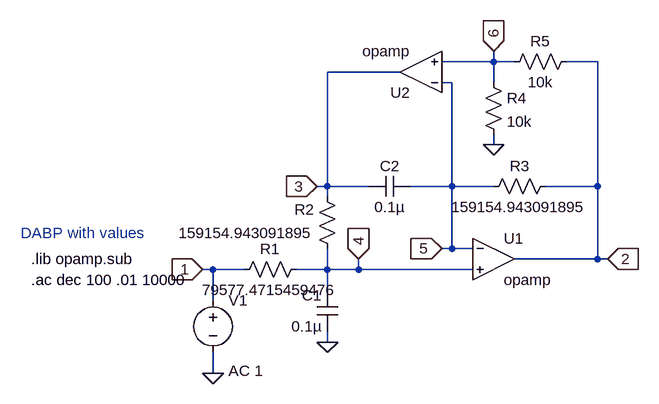
[diagram p0: schematic DABPn.asc]
DABPn.asc, the LTspice schematic file:
Version 4
SHEET 1 880 680
WIRE 272 -80 272 -96
WIRE 272 -80 192 -80
WIRE 304 -80 272 -80
WIRE 432 -80 384 -80
WIRE 128 -64 16 -64
WIRE 208 -48 192 -48
WIRE 272 -48 272 -80
WIRE 272 48 272 32
WIRE 16 112 16 -64
WIRE 16 112 0 112
WIRE 80 112 16 112
WIRE 208 112 208 -48
WIRE 208 112 144 112
WIRE 272 112 208 112
WIRE 432 112 432 -80
WIRE 432 112 352 112
WIRE 16 128 16 112
WIRE 208 208 208 112
WIRE 208 208 192 208
WIRE 240 208 208 208
WIRE 432 224 432 112
WIRE 432 224 304 224
WIRE 448 224 432 224
WIRE -160 240 -176 240
WIRE -112 240 -160 240
WIRE 16 240 16 208
WIRE 16 240 -32 240
WIRE 64 240 64 224
WIRE 64 240 16 240
WIRE 240 240 64 240
WIRE 16 272 16 240
WIRE -160 288 -160 240
WIRE 16 352 16 336
WIRE -160 400 -160 368
FLAG 16 352 0
FLAG 272 48 0
FLAG -160 400 0
FLAG -176 240 1
IOPIN -176 240 In
FLAG 448 224 2
IOPIN 448 224 In
FLAG 272 -96 6
IOPIN 272 -96 In
FLAG 192 208 5
IOPIN 192 208 In
FLAG 0 112 3
IOPIN 0 112 In
FLAG 64 224 4
IOPIN 64 224 In
SYMBOL OpAmps\\opamp 272 160 R0
SYMATTR InstName U1
SYMBOL OpAmps\\opamp 160 0 R180
SYMATTR InstName U2
SYMBOL res -16 224 R90
WINDOW 0 0 56 VBottom 2
WINDOW 3 32 56 VTop 2
SYMATTR InstName R1
SYMATTR Value 79577.4715459476
SYMBOL res 32 224 R180
WINDOW 0 36 76 Left 2
WINDOW 3 36 40 Left 2
SYMATTR InstName R2
SYMATTR Value 159154.943091895
SYMBOL res 256 128 R270
WINDOW 0 32 56 VTop 2
WINDOW 3 0 56 VBottom 2
SYMATTR InstName R3
SYMATTR Value 159154.943091895
SYMBOL res 288 -64 R270
WINDOW 0 32 56 VTop 2
WINDOW 3 0 56 VBottom 2
SYMATTR InstName R5
SYMATTR Value 10k
SYMBOL res 256 -64 R0
SYMATTR InstName R4
SYMATTR Value 10k
SYMBOL cap 144 96 R90
WINDOW 0 0 32 VBottom 2
WINDOW 3 32 32 VTop 2
SYMATTR InstName C2
SYMATTR Value 0.1µ
SYMBOL cap 32 336 R180
WINDOW 0 24 56 Left 2
WINDOW 3 24 8 Left 2
SYMATTR InstName C1
SYMATTR Value 0.1µ
SYMBOL voltage -160 272 R0
WINDOW 123 24 124 Left 2
WINDOW 39 0 0 Left 0
SYMATTR Value2 AC 1
SYMATTR InstName V1
SYMATTR Value ""
TEXT -440 224 Left 2 !.lib opamp.sub
TEXT -440 256 Left 2 !.ac dec 100 .01 10000
TEXT -456 184 Left 2 ;DABP with values

The netlist it stands for:
* DABPn.asc
XU1 5 4 2 opamp Aol=100K GBW=10Meg  ; pins invin noninvin out
XU2 5 6 3 opamp Aol=100K GBW=10Meg  ; pins invin noninvin out
R1 4 1 79577.4715459476
R2 4 3 159154.943091895
R3 5 2 159154.943091895
R5 6 2 10k
R4 6 0 10k
C2 5 3 0.1µ
C1 0 4 0.1µ
V1 1 0 AC 1
.lib opamp.sub
.ac dec 100 .01 10000
* DABP with values
.backanno
.end